# Altium schematic sheet Esquematico_microcotrolador_actuador1.SchDoc
size A4; Organization: Altium Limited; Address1: L3, 12a Rodborough Rd; Address2: Frenchs Forest; Address3: NSW; Address4: Australia 2086
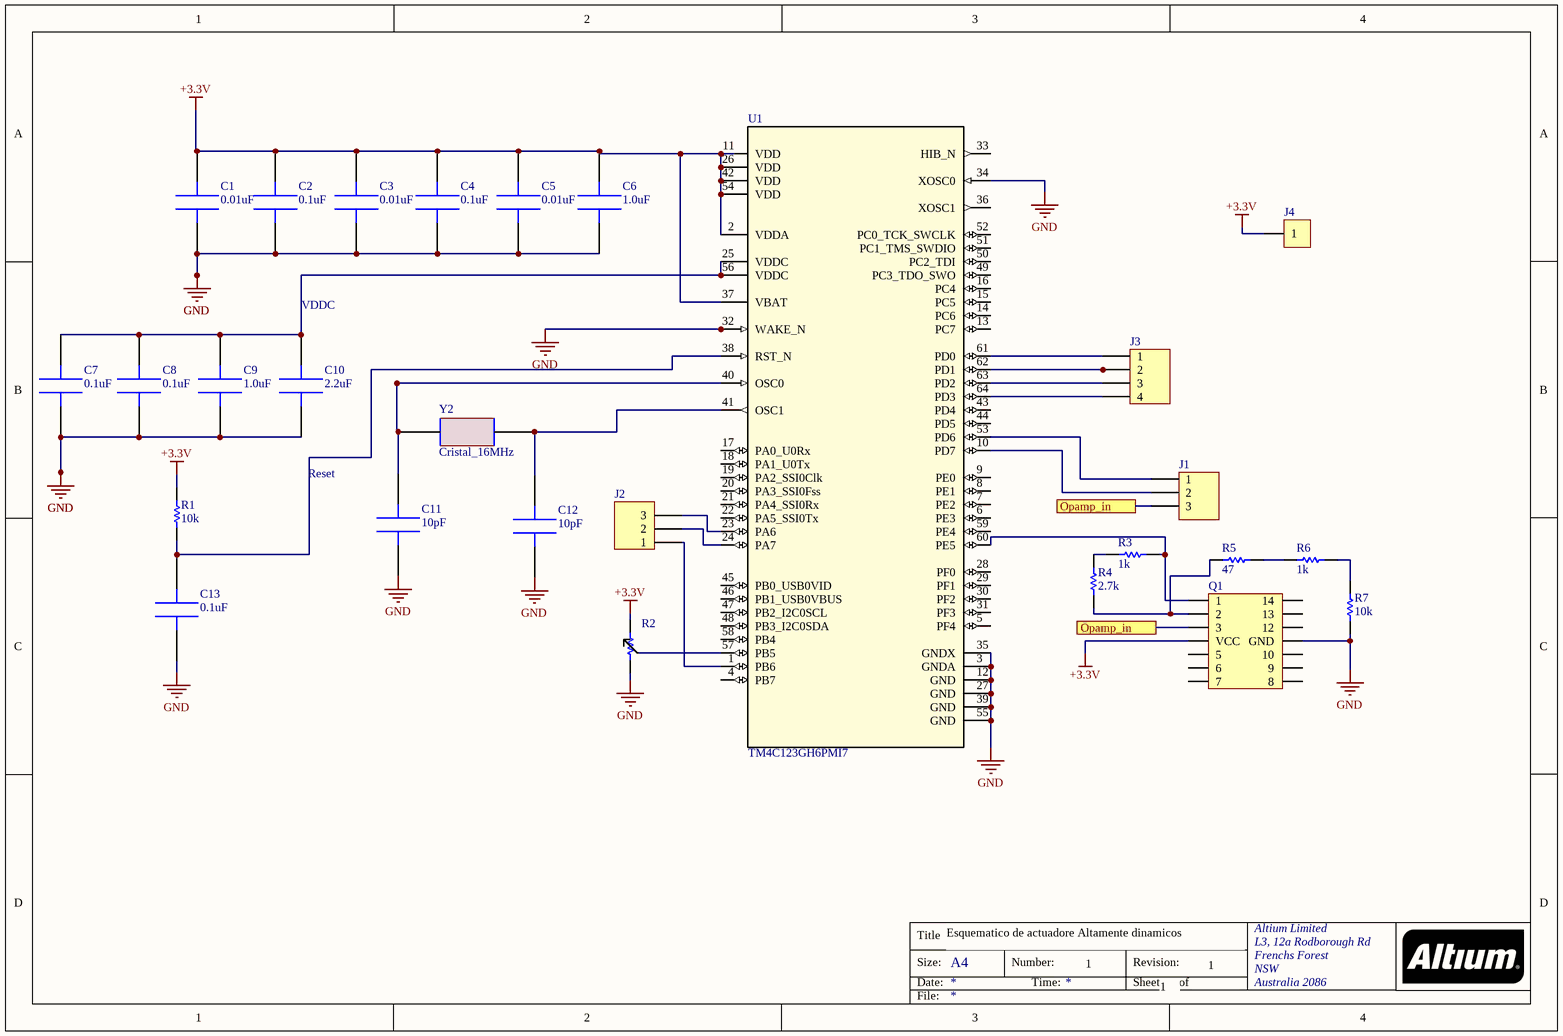
[diagram p0: Esquematico_microcotrolador_actuador1.SchDoc]

## Parts
C1  0.01uF  [Capacitor]
C2  0.1uF  [Capacitor]
C3  0.01uF  [Capacitor]
C4  0.1uF  [Capacitor]
C5  0.01uF  [Capacitor]
C6  1.0uF  [Capacitor]
C7  0.1uF  [Capacitor]
C8  0.1uF  [Capacitor]
C9  1.0uF  [Capacitor]
C10  2.2uF  [Capacitor]
C11  10pF  [Capacitor]
C12  10pF  [Capacitor]
C13  0.1uF  [Capacitor]
J1  HEADERS  [2_PIN_HEADER]  (value not drawn)
J2  HEADERS  [2_PIN_HEADER]  (value not drawn)
J3  4_HEADERS  [4_HEADERS]  (value not drawn)
J4  1_HEADER  [1_HEADER]  (value not drawn)
Q1  Op-amp  [Op-amp]  (value not drawn)
R1  10k  [resistencia]
R2  potenciometro  [Potenciometro]  (value not drawn)
R3  1k  [resistencia]
R4  2.7k  [resistencia]
R5  47  [resistencia]
R6  1k  [resistencia]
R7  10k  [resistencia]
U1  TM4C123GH6PMI7  [PM0064A_N]
Y2  Cristal_16MHz  [cristal_16MHz]

## Ports
Opamp_in

## Nets
+3.3V: C1.2 C2.2 C3.2 C4.2 C5.2 C6.2 J4.1 Q1.4(VCC) R1.2 R2.2 U1.2(VDDA) U1.11(VDD) U1.26(VDD) U1.37(VBAT) U1.42(VDD) U1.54(VDD)
GND: C1.1 C2.1 C3.1 C4.1 C5.1 C6.1 C7.1 C8.1 C9.1 C10.1 C11.2 C12.2 C13.1 Q1.11(GND) R2.1 R7.2 U1.3(GNDA) U1.12(GND) U1.27(GND) U1.32(WAKE_N) U1.34(XOSC0) U1.35(GNDX) U1.39(GND) U1.55(GND)
Opamp_in: J1.3 Q1.3 ; port Opamp_in
NetC7_2: C7.2 C8.2 C9.2 C10.2 U1.25(VDDC) U1.56(VDDC)
NetC11_1: C11.1 U1.40(OSC0) Y2.1
NetC12_1: C12.1 U1.41(OSC1) Y2.2
NetC13_2: C13.2 R1.1 U1.38(RST_N)
NetJ1_1: J1.1 U1.53(PD6)
NetJ1_2: J1.2 U1.10(PD7)
NetJ2_1: J2.1 U1.1(PB6)
NetJ2_2: J2.2 U1.24(PA7)
NetJ2_3: J2.3 U1.23(PA6)
NetJ3_1: J3.1 U1.61(PD0)
NetJ3_2: J3.2 U1.62(PD1)
NetJ3_3: J3.3 U1.63(PD2)
NetJ3_4: J3.4 U1.64(PD3)
NetQ1_1: Q1.1 R3.1 U1.60(PE5)
NetQ1_2: Q1.2 R4.1 R5.2
NetR2_3: R2.3 U1.57(PB5)
NetR3_2: R3.2 R4.2
NetR5_1: R5.1 R6.2
NetR6_1: R6.1 R7.1

Not connected (* = marked no-connect by the designer): Q1 5 6 7 8 9 10 12 13 14; U1 4(PB7) 5(PF4) 6(PE3) 7(PE2) 8(PE1) 9(PE0) 13(PC7) 14(PC6) 15(PC5) 16(PC4) 17(PA0_U0Rx) 18(PA1_U0Tx) 19(PA2_SSI0Clk) 20(PA3_SSI0Fss) 21(PA4_SSI0Rx) 22(PA5_SSI0Tx) 28(PF0) 29(PF1) 30(PF2) 31(PF3) 33(HIB_N) 36(XOSC1) 43(PD4) 44(PD5) 45(PB0_USB0VID) 46(PB1_USB0VBUS) 47(PB2_I2C0SCL) 48(PB3_I2C0SDA) 49(PC3_TDO_SWO) 50(PC2_TDI) 51(PC1_TMS_SWDIO) 52(PC0_TCK_SWCLK) 58(PB4) 59(PE4)

## Notes on the sheet
- VDDC
- Reset
- Esquematico de actuadore Altamente dinamicos
- 1
- Title
- Size:
- Date:
- A4
- Number:
- Time:
- Revision:
- Sheet
- of
- File:

## Library data of the parts
C1-C13 = CAP_0.01uF: Supplier 1: Digi-Key; Supplier Part Number 1: 587-1223-6-ND
R1 R3-R7 = Resisistencia
U1 = TM4C123GH6PMI7: No Description Available; Mfr_Name: Texas Instruments; PartNumber: TM4C123GH6PMTR; Alternate_PartNumber: TM4C123GH6PMT; CompType: IC; Type: DEV; RefDes: RefDes; Copyright: Copyright (C) 2021 Ultra Librarian. All rights reserved.; Manufacturer_Part_Number: TM4C123GH6PMI7; Application_BuildNumber: *; PackageReference: PM0064A; MountType: SMT; RoHS: Y; Manufacturer: Texas Instruments